# EAGLE design summoning (EAGLE 9.2.2)
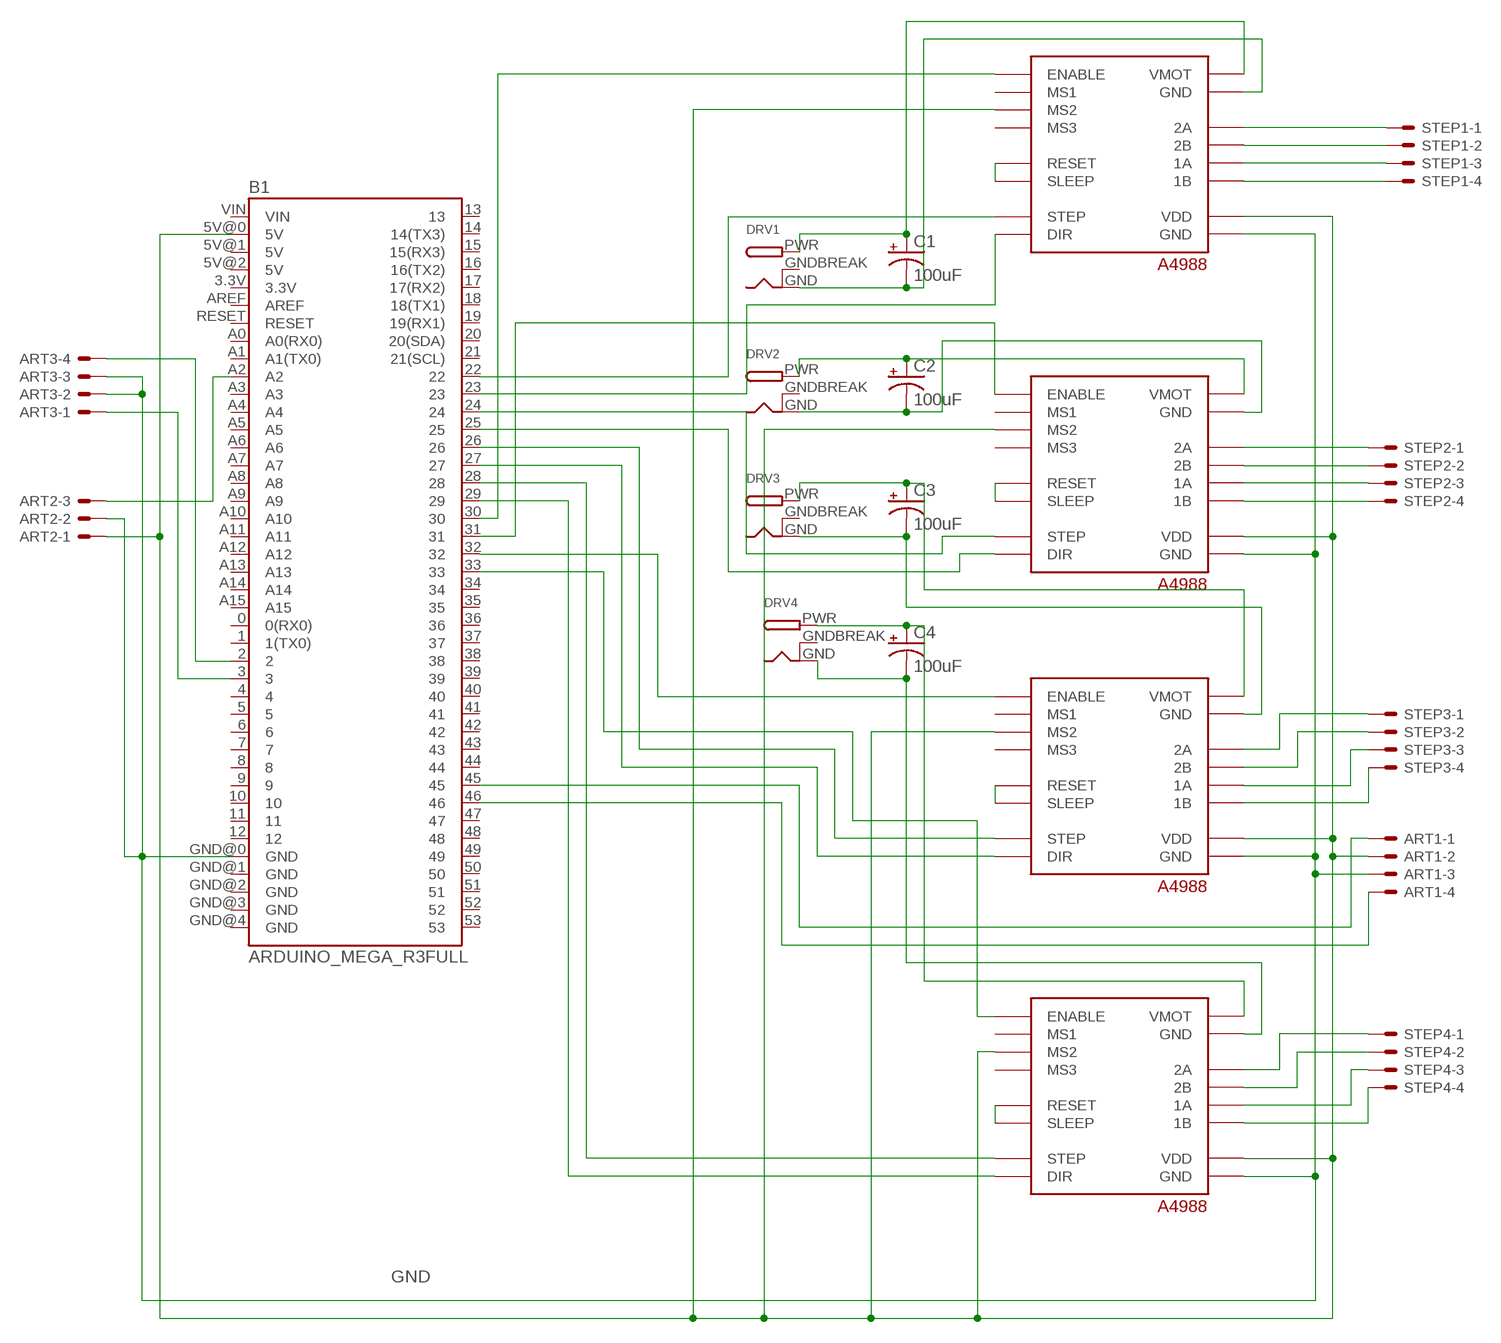
[diagram p0: schematic, sheet 1]

## Parts
ART1  KK-156-4  [KK-156-4]
ART2  KK-156-3  [KK-156-3]
ART3  KK-156-4  [KK-156-4]
B1  ARDUINO_MEGA_R3FULL  [ARDUINO_MEGA]
C1  100uF  100UF-POLAR-RADIAL-2.5MM-25V-20%  [CPOL-RADIAL-2.5MM-6.5MM]
C2  100uF  100UF-POLAR-RADIAL-2.5MM-25V-20%  [CPOL-RADIAL-2.5MM-6.5MM]
C3  100uF  100UF-POLAR-RADIAL-2.5MM-25V-20%  [CPOL-RADIAL-2.5MM-6.5MM]
C4  100uF  100UF-POLAR-RADIAL-2.5MM-25V-20%  [CPOL-RADIAL-2.5MM-6.5MM]
DRV1  DCBARRELPTH  [DCJACK_2MM_PTH]
DRV2  DCBARRELPTH  [DCJACK_2MM_PTH]
DRV3  DCBARRELPTH  [DCJACK_2MM_PTH]
DRV4  DCBARRELPTH  [DCJACK_2MM_PTH]
POL1  A4988_ALL  [A4988_ALL]
POL2  A4988_ALL  [A4988_ALL]
POL3  A4988_ALL  [A4988_ALL]
POL4  A4988_ALL  [A4988_ALL]
STEP1  KK-156-4  [KK-156-4]
STEP2  KK-156-4  [KK-156-4]
STEP3  KK-156-4  [KK-156-4]
STEP4  KK-156-4  [KK-156-4]

## Nets
GND: ART1.3 ART2.2 ART3.2 ART3.3 B1.GND@0(GND) POL1.P16(GND) POL2.P16(GND) POL3.P16(GND) POL4.P16(GND)
N$1: ART1.2 ART2.1 B1.5V@0(5V) POL1.P3(MS2) POL1.P15(VDD) POL2.P3(MS2) POL2.P15(VDD) POL3.P3(MS2) POL3.P15(VDD) POL4.P3(MS2) POL4.P15(VDD)
N$3: C4.2(-) DRV4.GND POL4.P10(GND)
N$4: C4.1(+) DRV4.PWR POL4.P9(VMOT)
N$5: C3.1(+) DRV3.PWR POL3.P9(VMOT)
N$6: C3.2(-) DRV3.GND POL3.P10(GND)
N$7: C2.2(-) DRV2.GND POL2.P10(GND)
N$8: C2.1(+) DRV2.PWR POL2.P9(VMOT)
N$9: C1.2(-) DRV1.GND POL1.P10(GND)
N$10: C1.1(+) DRV1.PWR POL1.P9(VMOT)
N$11: POL1.P11(2A) STEP1.1
N$12: POL1.P12(2B) STEP1.2
N$13: POL1.P13(1A) STEP1.3
N$14: POL1.P14(1B) STEP1.4
N$15: POL2.P11(2A) STEP2.1
N$16: POL2.P12(2B) STEP2.2
N$17: POL2.P13(1A) STEP2.3
N$18: POL2.P14(1B) STEP2.4
N$19: POL3.P11(2A) STEP3.1
N$20: POL3.P12(2B) STEP3.2
N$21: POL3.P13(1A) STEP3.3
N$22: POL3.P14(1B) STEP3.4
N$23: POL4.P11(2A) STEP4.1
N$24: POL4.P12(2B) STEP4.2
N$25: POL4.P13(1A) STEP4.3
N$26: POL4.P14(1B) STEP4.4
N$27: B1.27 POL3.P8(DIR)
N$28: B1.26 POL3.P7(STEP)
N$29: ART2.3 B1.A2
N$30: ART3.4 B1.2
N$31: ART3.1 B1.3
N$32: ART1.1 B1.45
N$33: ART1.4 B1.46
N$34: B1.30 POL1.P1(ENABLE)
N$35: B1.22 POL1.P7(STEP)
N$36: B1.23 POL1.P8(DIR)
N$37: B1.24 POL2.P7(STEP)
N$38: B1.25 POL2.P8(DIR)
N$39: B1.28 POL4.P7(STEP)
N$40: B1.29 POL4.P8(DIR)
N$41: B1.31 POL2.P1(ENABLE)
N$42: B1.32 POL3.P1(ENABLE)
N$43: B1.33 POL4.P1(ENABLE)
N$44: POL1.P5(RESET) POL1.P6(SLEEP)
N$45: POL2.P5(RESET) POL2.P6(SLEEP)
N$46: POL3.P5(RESET) POL3.P6(SLEEP)
N$47: POL4.P5(RESET) POL4.P6(SLEEP)
Unconnected: B1.0(0(RX0)) B1.1(1(TX0)) B1.3.3V B1.4 B1.5 B1.5V@1(5V) B1.5V@2(5V) B1.6 B1.7 B1.8 B1.9 B1.10 B1.11 B1.12 B1.13 B1.14(14(TX3)) B1.15(15(RX3)) B1.16(16(TX2)) B1.17(17(RX2)) B1.18(18(TX1)) B1.19(19(RX1)) B1.20(20(SDA)) B1.21(21(SCL)) B1.34 B1.35 B1.36 B1.37 B1.38 B1.39 B1.40 B1.41 B1.42 B1.43 B1.44 B1.47 B1.48 B1.49 B1.50 B1.51 B1.52 B1.53 B1.A0(A0(RX0)) B1.A1(A1(TX0)) B1.A3 B1.A4 B1.A5 B1.A6 B1.A7 B1.A8 B1.A9 B1.A10 B1.A11 B1.A12 B1.A13 B1.A14 B1.A15 B1.AREF B1.GND@1(GND) B1.GND@2(GND) B1.GND@3(GND) B1.GND@4(GND) B1.RESET B1.VIN POL1.P2(MS1) POL1.P4(MS3) POL2.P2(MS1) POL2.P4(MS3) POL3.P2(MS1) POL3.P4(MS3) POL4.P2(MS1) POL4.P4(MS3)

## Power pins joined to a net without a drawn wire
GNDBREAK: DRV1.GNDBREAK DRV2.GNDBREAK DRV3.GNDBREAK DRV4.GNDBREAK

## Library data of the parts
ART1 ART3 STEP1-STEP4 = con-molex:KK-156-4: KK 156 HEADER Source: http://www.molex.com/pdm_docs/sd/026604100_sd.pdf; MF: MOLEX; OC_FARNELL: unknown; OC_NEWARK: unknown
ART2 = con-molex:KK-156-3: KK 156 HEADER Source: http://www.molex.com/pdm_docs/sd/026604100_sd.pdf; MF: MOLEX; OC_FARNELL: unknown; OC_NEWARK: unknown
B1 = SparkFun-Boards:ARDUINO_MEGA_R3: Arduino Mega R3 ATmega2560 R3 compatible footprint. SparkFun Products: Arduino Mega 2560 R3 <https://www.sparkfun.com/products/11061>
C1-C4 = SparkFun-Capacitors:100UF-POLAR: 100µF polarized capacitors A capacitor is a passive two-terminal electrical component used to store electrical energy temporarily in an electric field.; PROD_ID: CAP-08439
DRV1-DRV4 = adafruit:DCBARREL: 2.0mm DC Barrel Jack DCJACK_2MM_PTH - Through Hole Jack (4UConnector: 05537)
POL1-POL4 = A4988:A4988_ALL

## Net classes
0 default: width 0.381 mm, clearance 0.381 mm

## Board
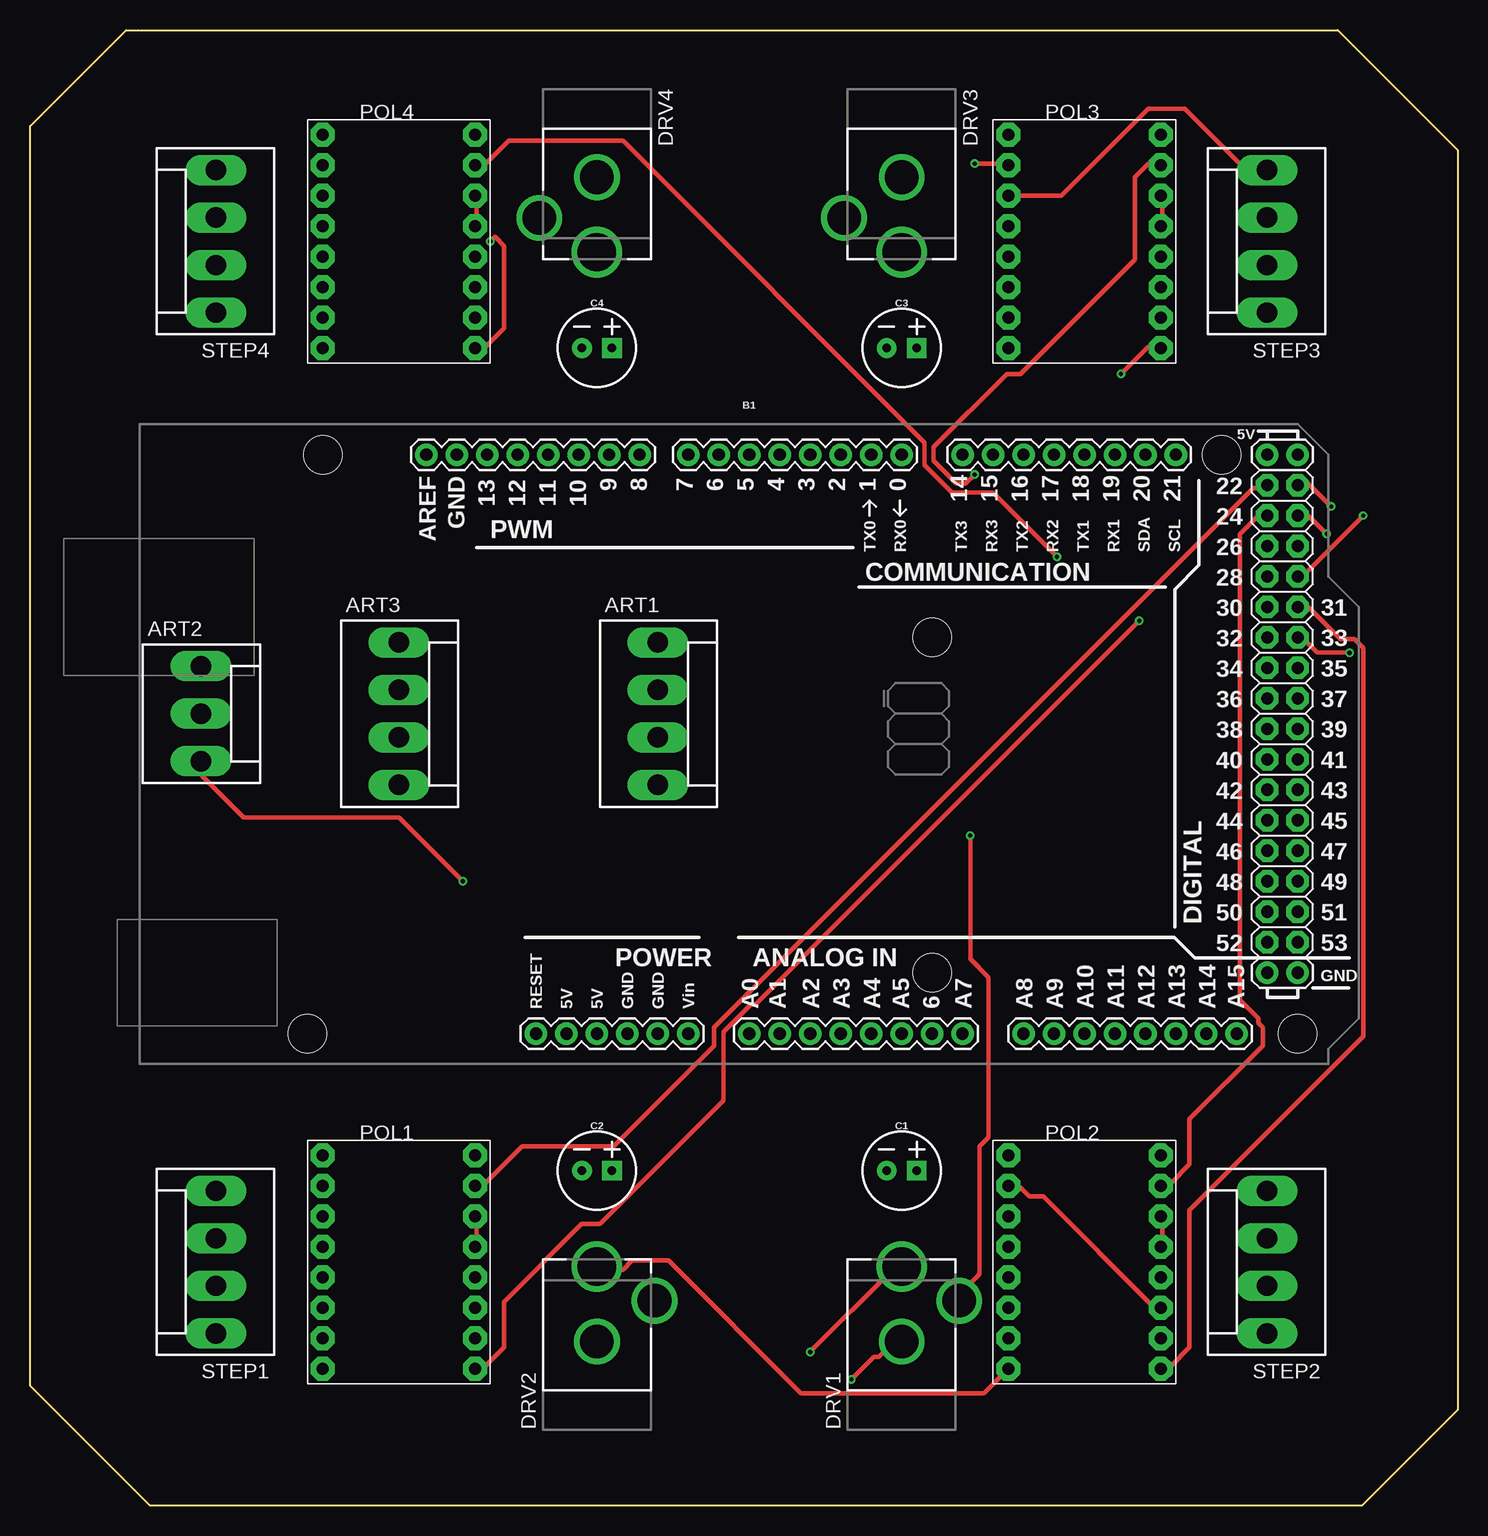
[diagram p1: board, top side]
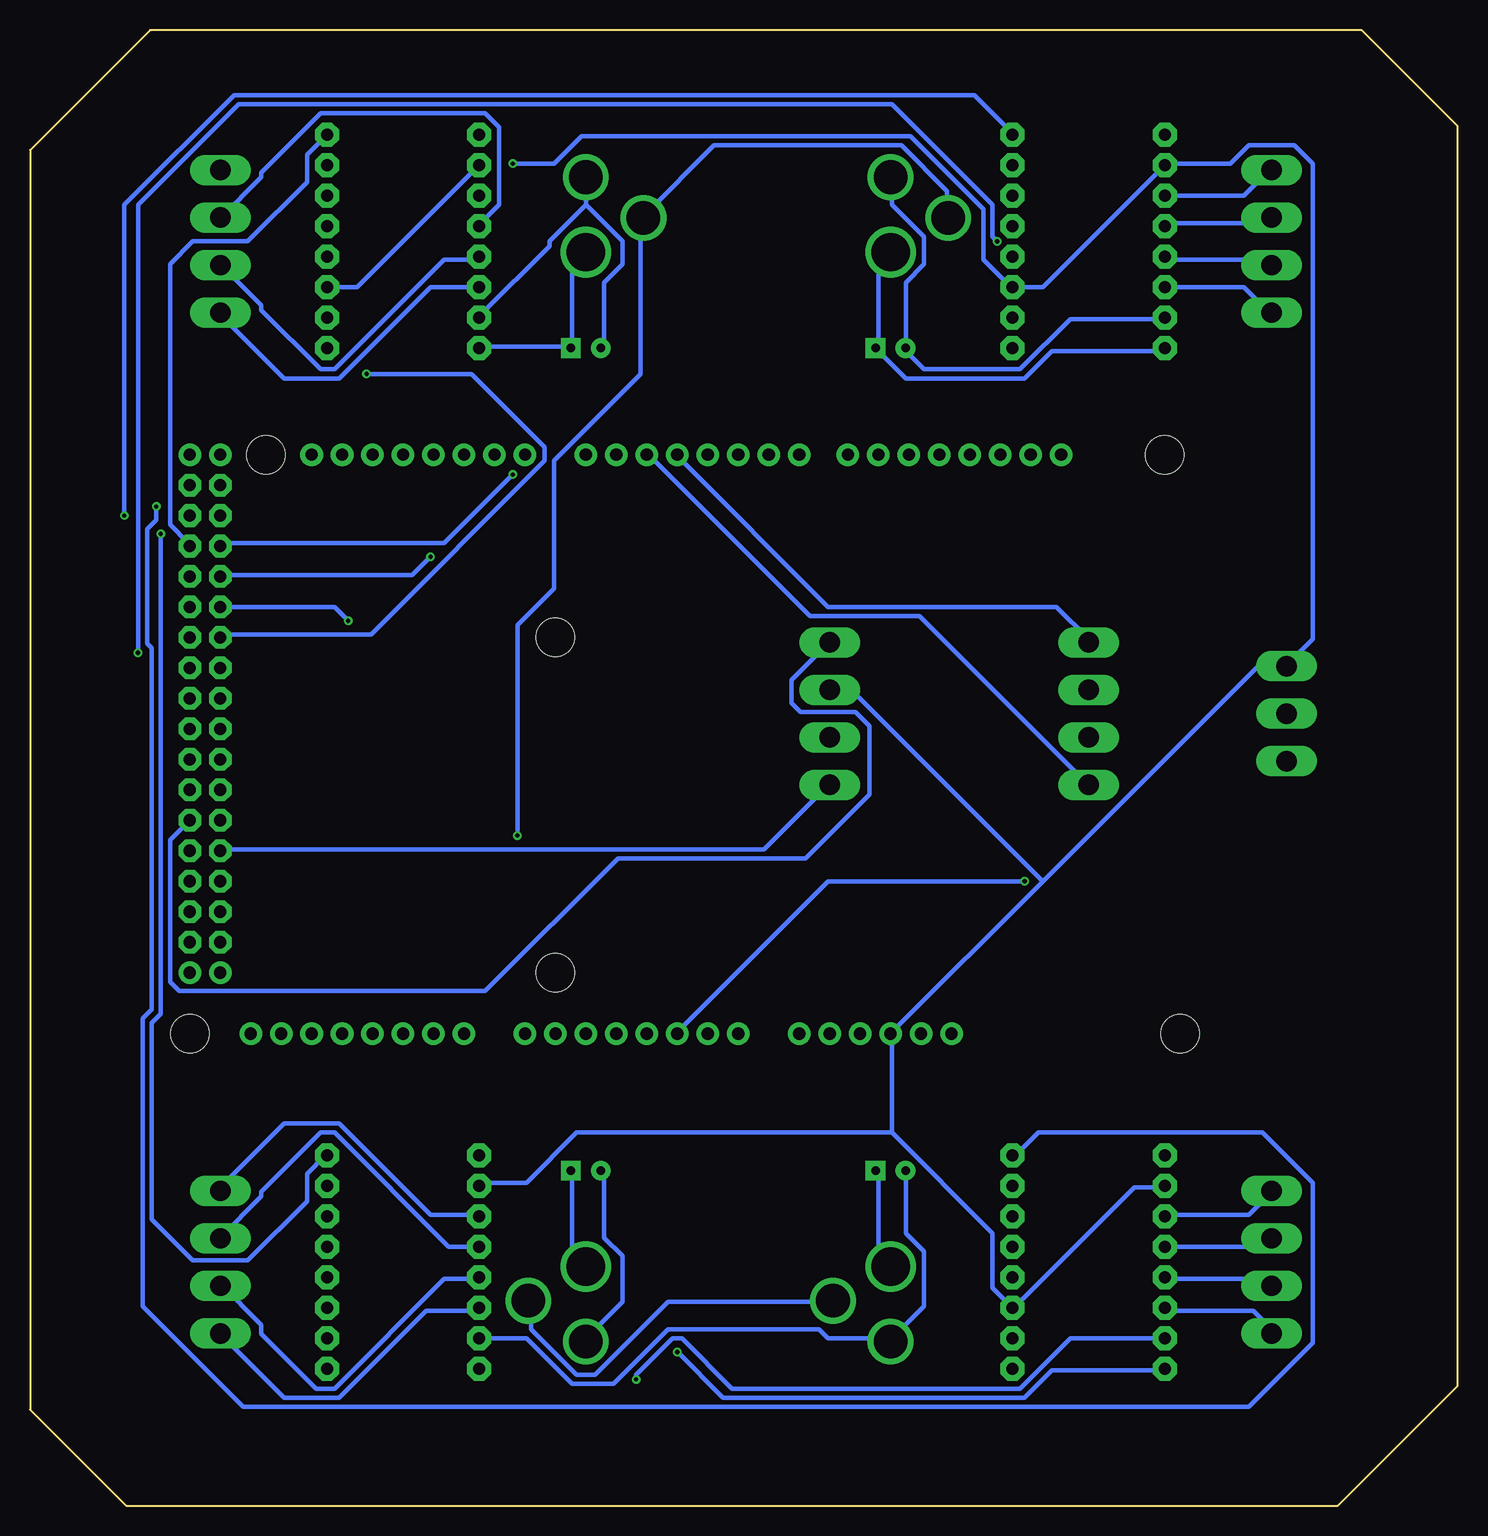
[diagram p2: board, bottom side, seen from below]

Size 119 x 123 mm. Coordinates in mm from the lower left corner, seen from the top.
Copper layers (1*16): Top 0.0356mm / dielectric 1.5011mm / Bottom 0.0356mm
Design rules "LaenPCBOrder": minimum track width 6mil, minimum drill 13mil, track to track 6mil, track to pad 6mil, pad to pad 6mil, via to via 6mil, smd to smd 6mil, copper to edge 15mil, drill to drill 6mil, minimum pad ring 7mil, minimum via ring 7mil, stop-mask expansion 3mil, vias tented up to drill 0mil, thermal gap 10mil

### Footprints (pad centres in the part's own frame; a part is rotated, then mirrored left to right if it is on the bottom)
KK-156-4 = drill 1.7 pad 2.184 long: 1 -5.94,0; 2 -1.98,0; 3 1.98,0; 4 5.94,0
KK-156-3 = drill 1.7 pad 2.184 long: 1 -3.96,0; 2 0,0; 3 3.96,0
ARDUINO_MEGA = drill 1.016 pad 1.88: 0 13.97,24.13; 1 11.43,24.13; 2 8.89,24.13; 3 6.35,24.13; 3.3V -13.97,-24.13; 4 3.81,24.13; 5 1.27,24.13; 5V@0 -11.43,-24.13; 5V@1 44.45,24.13; 5V@2 46.99,24.13; 6 -1.27,24.13; 7 -3.81,24.13; 8 -7.874,24.13; 9 -10.414,24.13; 10 -12.954,24.13; 11 -15.494,24.13; 12 -18.034,24.13; 13 -20.574,24.13; 14 19.05,24.13; 15 21.59,24.13; 16 24.13,24.13; 17 26.67,24.13; 18 29.21,24.13; 19 31.75,24.13; 20 34.29,24.13; 21 36.83,24.13; A0 1.27,-24.13; A1 3.81,-24.13; A2 6.35,-24.13; A3 8.89,-24.13; A4 11.43,-24.13; A5 13.97,-24.13; A6 16.51,-24.13; A7 19.05,-24.13; A8 24.13,-24.13; A9 26.67,-24.13; A10 29.21,-24.13; A11 31.75,-24.13; A12 34.29,-24.13; A13 36.83,-24.13; A14 39.37,-24.13; A15 41.91,-24.13; AREF -25.654,24.13; GND@0 -8.89,-24.13; GND@1 -6.35,-24.13; GND@2 44.45,-19.05; GND@3 46.99,-19.05; GND@4 -23.114,24.13; RESET -16.51,-24.13; VIN -3.81,-24.13 | drill 1.016 pad 1.88 octagon: 22 44.45,21.59; 23 46.99,21.59; 24 44.45,19.05; 25 46.99,19.05; 26 44.45,16.51; 27 46.99,16.51; 28 44.45,13.97; 29 46.99,13.97; 30 44.45,11.43; 31 46.99,11.43; 32 44.45,8.89; 33 46.99,8.89; 34 44.45,6.35; 35 46.99,6.35; 36 44.45,3.81; 37 46.99,3.81; 38 44.45,1.27; 39 46.99,1.27; 40 44.45,-1.27; 41 46.99,-1.27; 42 44.45,-3.81; 43 46.99,-3.81; 44 44.45,-6.35; 45 46.99,-6.35; 46 44.45,-8.89; 47 46.99,-8.89; 48 44.45,-11.43; 49 46.99,-11.43; 50 44.45,-13.97; 51 46.99,-13.97; 52 44.45,-16.51; 53 46.99,-16.51 | hole 3.2: -34.29,24.13; -35.56,-24.13; 16.51,8.89; 16.51,-19.05; 40.64,24.13; 46.99,-24.13
CPOL-RADIAL-2.5MM-6.5MM = drill 0.7 pad 1.651 square: 1 1.25,0 | drill 0.7 pad 1.651: 2 -1.25,0
DCJACK_2MM_PTH = drill 2.8: GND 0,7.35; GNDBREAK 4.8,10.75 | drill 3.2: PWR 0,13.6
A4988_ALL = drill 1 pad 2 octagon: P1 -6.35,8.89; P2 -6.35,6.35; P3 -6.35,3.81; P4 -6.35,1.27; P5 -6.35,-1.27; P6 -6.35,-3.81; P7 -6.35,-6.35; P8 -6.35,-8.89; P9 6.35,8.89; P10 6.35,6.35; P11 6.35,3.81; P12 6.35,1.27; P13 6.35,-1.27; P14 6.35,-3.81; P15 6.35,-6.35; P16 6.35,-8.89

### Placement (x,y rotation side)
ART1  52.34,66.01 270 top
ART2  14.24,66.01 270 top
ART3  30.75,66.01 270 top
B1  58.69,63.47 0 top
C1  72.66,27.91 0 top
C2  47.26,27.91 0 top
C3  72.66,96.49 0 top
C4  47.26,96.49 0 top
DRV1  72.66,6.32 0 top
DRV2  47.26,6.32 0 top
DRV3  72.66,118.08 180 top
DRV4  47.26,118.08 180 top
POL1  30.75,20.29 180 top
POL2  87.9,20.29 180 top
POL3  87.9,105.38 180 top
POL4  30.75,105.38 180 top
STEP1  15.51,20.29 90 top
STEP2  103.14,20.29 90 top
STEP3  103.14,105.38 90 top
STEP4  15.51,105.38 90 top

### Tracks (layer width: path | path; a pad name or v marks a point on that pad's centre or on a via)
GND
  pour Top: 1.54,113 9.16,120.62 10.43,120.62 108.22,120.62 115.84,113 115.84,8.86 109.49,2.51 10.43,2.51 1.54,11.4
GNDBREAK  (via drill 0.35)
  Top 0.381: v78.38,55.85 78.38,45.56 79.9,44.04 79.9,30.7 79.14,29.94 79.14,19.27 77.23,17.37 DRV1.GNDBREAK
  Bottom 0.381: DRV4.GNDBREAK 42.56,107.67 42.56,109.57 46.37,113.38 61.99,113.38 67.71,107.67 DRV3.GNDBREAK 68.09,107.28 68.09,94.33 75.33,87.09 75.33,76.42 78.38,73.38 v78.38,55.85 | DRV2.GNDBREAK 52.09,16.99 65.8,16.99 71.9,10.89 73.42,10.89 77.23,14.7 77.23,16.99 DRV1.GNDBREAK
N$1  (via drill 0.35)
  Top 0.381: POL2.P3 94,16.61 93.62,16.61 84.47,25.75 83.33,25.75 82.57,26.51 81.8,26.51 POL2.P15 | v78.76,111.86 81.42,111.86 POL3.P15
  Bottom 0.381: POL3.P3 91.71,101.57 POL3.P15 | 47.13,31.08 47.13,39.09 B1.5V@0 34.56,52.04 | 47.13,31.08 38.75,22.7 38.75,18.13 POL1.P3 36.85,16.61 26.94,26.51 24.65,26.51 POL1.P15 | 34.56,52.04 16.65,69.95 14.37,69.95 ART2.1 13.99,70.33 12.08,72.23 12.08,111.86 13.61,113.38 17.42,113.38 18.94,111.86 24.27,111.86 POL4.P15 34.56,101.57 POL4.P3 37.23,101.57 39.51,103.86 39.51,108.05 45.61,114.14 73.04,114.14 75.33,111.86 v78.76,111.86 | 34.56,52.04 50.18,67.66 52.09,67.66 ART1.2 | 47.13,31.08 73.42,31.08 77.61,26.89 81.42,26.89 POL2.P15
N$3
  Bottom 0.381: DRV4.GND 47.13,110.71 47.13,108.43 44.47,105.76 44.47,103.47 45.99,101.95 45.99,96.62 C4.2 45.99,96.24 44.47,94.71 36.47,94.71 32.27,98.9 24.65,98.9 POL4.P10
N$4
  Bottom 0.381: DRV4.PWR 47.51,104.24 48.28,103.47 48.28,96.62 C4.1 48.28,96.24 45.99,93.95 36.08,93.95 33.8,96.24 24.65,96.24 POL4.P9
N$5
  Bottom 0.381: POL3.P9 81.42,96.62 74.18,96.62 C3.1 73.8,96.62 73.8,103.09 72.66,104.24 DRV3.PWR
N$6
  Bottom 0.381: 72.66,108.43 69.61,105.38 69.61,103.47 71.14,101.95 71.14,96.62 C3.2 | DRV3.GND 72.66,108.43 | 72.66,108.43 75.71,105.38 75.71,105 81.42,99.28 POL3.P10
N$7
  Bottom 0.381: C2.2 45.99,27.66 45.99,22.7 44.47,21.18 44.47,16.61 47.13,13.94 DRV2.GND 47.51,13.94 52.47,13.94 53.23,14.7 65.8,14.7 70.37,10.13 73.8,10.13 77.61,13.94 POL2.P10
N$8
  Top 0.381: POL2.P9 79.52,9.37 64.28,9.37 53.23,20.42 50.18,20.42 49.42,19.66 47.51,19.66 DRV2.PWR
  Bottom 0.381: C2.1 48.28,27.66 48.28,20.8 47.51,20.04 DRV2.PWR
N$9  (via drill 0.35)
  Top 0.381: v68.47,10.51 70.37,12.42 70.75,12.42 71.9,13.56 72.66,13.56 DRV1.GND
  Bottom 0.381: C1.2 71.14,27.66 71.14,22.32 69.61,20.8 69.61,16.99 72.66,13.94 DRV1.GND | POL1.P10 32.27,13.94 36.47,9.75 60.47,9.75 64.66,13.94 65.42,13.94 68.47,10.89 v68.47,10.51
N$10  (via drill 0.35)
  Top 0.381: v65.04,12.8 71.9,19.66 72.66,19.66 DRV1.PWR
  Bottom 0.381: C1.1 73.8,27.66 73.8,21.18 72.66,20.04 DRV1.PWR | v65.04,12.8 61.23,8.99 36.08,8.99 33.8,11.27 24.65,11.27 POL1.P9
N$11
  Bottom 0.381: POL1.P11 24.27,16.23 17.03,16.23 15.51,14.7 STEP1.1
N$12
  Bottom 0.381: POL1.P12 24.27,18.89 15.89,18.89 15.51,18.51 STEP1.2
N$13
  Bottom 0.381: POL1.P13 15.89,21.56 15.51,21.94 STEP1.3
N$14
  Bottom 0.381: POL1.P14 24.27,24.23 17.42,24.23 15.51,26.13 STEP1.4
N$15
  Bottom 0.381: POL2.P11 81.8,16.23 86,16.23 93.23,8.99 97.81,8.99 103.14,14.32 STEP2.1
N$16
  Bottom 0.381: POL2.P12 81.8,18.89 84.47,18.89 93.62,9.75 95.14,9.75 99.71,14.32 99.71,15.08 103.14,18.51 STEP2.2
N$17
  Bottom 0.381: POL2.P13 84.09,21.56 93.62,31.08 94.76,31.08 99.71,26.13 99.71,25.75 103.14,22.32 STEP2.3
N$18
  Bottom 0.381: POL2.P14 81.8,24.23 85.61,24.23 93.23,31.85 97.81,31.85 103.14,26.51 STEP2.4
N$19
  Bottom 0.381: POL3.P11 85.61,101.57 93.23,93.95 97.81,93.95 103.14,99.28 STEP3.1
N$20
  Bottom 0.381: POL3.P12 81.8,103.86 84.47,103.86 93.62,94.71 94.76,94.71 99.71,99.66 99.71,100.05 103.14,103.47 STEP3.2
N$21
  Bottom 0.381: POL3.P13 81.42,106.9 79.9,108.43 79.9,114.91 81.04,116.05 94.76,116.05 99.71,111.09 99.71,110.71 103.14,107.28 STEP3.3
N$22
  Top 0.381: POL3.P14 86,109.19 93.23,116.43 96.28,116.43 101.23,111.48 103.14,111.48 STEP3.4
N$23
  Bottom 0.381: POL4.P11 17.8,101.57 15.51,99.28 STEP4.1
N$24
  Bottom 0.381: POL4.P12 24.27,103.86 15.89,103.86 15.51,103.47 STEP4.2
N$25
  Bottom 0.381: POL4.P13 24.27,106.9 15.89,106.9 15.51,107.28 STEP4.3
N$26
  Bottom 0.381: POL4.P14 17.8,109.19 15.51,111.48 STEP4.4
N$27
  Bottom 0.381: POL3.P8 95.9,112.62 95.9,110.33 100.85,105.38 105.43,105.38 107.33,103.47 107.33,81.76 105.81,80.23 B1.27
N$28  (via drill 0.35)
  Top 0.381: v78.76,85.95 77.99,85.19 77.23,85.19 75.33,87.09 75.33,88.23 81.42,94.33 82.57,94.33 92.09,103.86 92.09,110.71 93.23,111.86 94,111.86 POL3.P7
  Bottom 0.381: v78.76,85.95 84.47,80.23 103.14,80.23 B1.26
N$29  (via drill 0.35)
  Top 0.381: v36.08,52.04 30.75,57.37 17.8,57.37 14.37,60.8 14.37,61.95 ART2.3
  Bottom 0.381: v36.08,52.04 52.47,52.04 65.04,39.47 B1.A2
N$30
  Bottom 0.381: B1.2 67.33,87.47 53.99,74.14 44.85,74.14 30.75,60.04 ART3.4
N$31
  Bottom 0.381: B1.3 65.04,87.47 52.47,74.9 33.42,74.9 30.75,72.23 ART3.1
N$32
  Bottom 0.381: B1.45 107.33,55.47 107.33,43.66 106.57,42.9 81.04,42.9 69.99,53.95 54.37,53.95 49.04,59.28 49.04,64.99 50.18,66.14 54.75,66.14 55.52,66.9 55.52,68.8 52.47,71.85 ART1.1
N$33
  Bottom 0.381: B1.46 103.14,54.71 57.8,54.71 52.47,60.04 ART1.4
N$34  (via drill 0.35)
  Top 0.381: v92.47,73.76 60.47,41.75 60.09,41.75 57.8,39.47 57.8,33.75 47.51,23.47 45.99,23.47 39.51,16.99 39.51,13.18 37.99,11.65 37.23,11.65 POL1.P1
  Bottom 0.381: B1.30 93.62,74.9 v92.47,73.76
N$35
  Top 0.381: B1.22 103.14,84.81 102,84.81 57.04,39.85 57.04,38.32 48.66,29.94 41.04,29.94 37.99,26.89 37.23,26.89 POL1.P7
N$36  (via drill 0.35)
  Top 0.381: v108.47,83.28 106.57,85.19 105.81,85.19 B1.23
  Bottom 0.381: v108.47,83.28 108.47,82.14 109.24,81.38 109.24,71.85 108.86,71.47 108.86,41.37 109.62,40.61 109.62,16.61 101.23,8.22 17.42,8.22 12.08,13.56 12.08,26.89 16.27,31.08 34.94,31.08 36.85,29.18 POL1.P8
N$37
  Top 0.381: B1.24 102.38,82.52 100.85,81 100.85,42.13 102.38,40.61 102.38,40.23 102.76,39.85 102.76,38.32 96.66,32.23 96.66,28.42 95.14,26.89 94.38,26.89 POL2.P7
N$38  (via drill 0.35)
  Top 0.381: B1.25 106.57,82.52 v108.09,81
  Bottom 0.381: v108.09,81 108.09,40.99 108.86,40.23 108.86,23.85 105.43,20.42 100.85,20.42 95.9,25.37 95.9,27.66 94.38,29.18 POL2.P8
N$39  (via drill 0.35)
  Top 0.381: v85.61,79.09 80.28,84.42 76.85,84.42 74.56,86.71 74.56,88.62 49.42,113.76 39.89,113.76 37.99,111.86 37.23,111.86 POL4.P7
  Bottom 0.381: v85.61,79.09 87.14,77.57 103.14,77.57 B1.28
N$40  (via drill 0.35)
  Top 0.381: v111.14,82.52 106.19,77.57 105.81,77.57 B1.29
  Bottom 0.381: v111.14,82.52 111.14,108.43 102,117.57 40.28,117.57 37.23,114.52 POL4.P8
N$41
  Top 0.381: B1.31 106.57,74.9 109.24,72.23 110.38,72.23 111.14,71.47 111.14,39.09 96.66,24.61 96.66,13.18 95.14,11.65 94.38,11.65 POL2.P1
N$42  (via drill 0.35)
  Top 0.381: v90.95,94.33 93.23,96.62 94,96.62 POL3.P1
  Bottom 0.381: v90.95,94.33 82.19,94.33 76.09,88.23 76.09,87.09 90.57,72.61 103.14,72.61 B1.32
N$43  (via drill 0.35)
  Top 0.381: v110,71.09 107.33,71.09 106.19,72.23 105.81,72.23 B1.33 | v38.37,105.38 38.75,105.76 39.51,105 39.51,98.14 37.99,96.62 37.23,96.62 POL4.P1
  Bottom 0.381: v110,71.09 110,108.43 101.62,116.81 47.13,116.81 38.75,108.43 38.75,105.76 v38.37,105.38
N$44
  Top 0.381: POL1.P5 37.23,21.56 37.23,23.85 POL1.P6
N$45
  Top 0.381: POL2.P5 94.38,21.56 94.38,23.85 POL2.P6
N$46
  Top 0.381: POL3.P5 94.38,106.9 94.38,109.19 POL3.P6
N$47
  Top 0.381: POL4.P5 37.23,106.9 37.23,109.19 POL4.P6